# EAGLE schematic 20251027-temp_board (EAGLE 9.6.2)
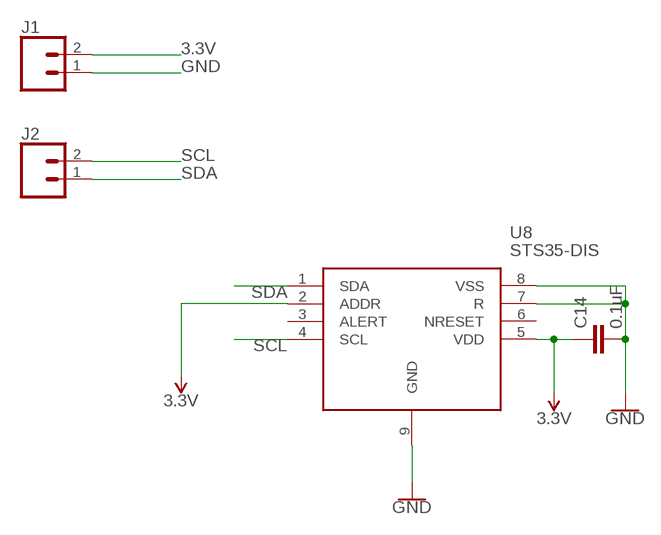
[diagram p0: schematic, sheet 1]

## Parts
C14  0.1uF  0.1UF-0603-25V-5%  [0603]
J1  CONN_02_1.5MM  [1X02_1.5MM_NO_SILK]
J2  CONN_02_1.5MM  [1X02_1.5MM_NO_SILK]
U8  STS35-DIS  [SON50P250X250X100-9N]

## Nets
3.3V: C14.1 J1.2 U8.2(ADDR) U8.5(VDD)
GND: C14.2 J1.1 U8.7(R) U8.8(VSS) U8.9(GND)
SCL: J2.2 U8.4(SCL)
SDA: J2.1 U8.1(SDA)
Unconnected: U8.3(ALERT) U8.6(NRESET)

## Library data of the parts
C14 = SparkFun-Capacitors:0.1UF: 0.1µF ceramic capacitors A capacitor is a passive two-terminal electrical component used to store electrical energy temporarily in an electric field.; PROD_ID: CAP-08604
J1 J2 = SparkFun-Connectors:CONN_02: Multi connection point. Often used as Generic Header-pin footprint for 0.1 inch spaced/style header connections On any of the 0.1 inch spaced packages, you can populate with these: Break Away Headers - Straight <https://www.sparkfun.com/products/116> (PRT-00116) Break Away Male Headers - Right Angle <https://www.sparkfun.com/products/553> (PRT-00553) Female Headers <https://www.sparkfun.com/products/115> (PRT-00115) Break Away Headers - Machine Pin <https://www.sparkfun.com/products/117> (PRT-00117) Break Away Female Headers - Swiss Machine Pin <https://www.sparkfun.com/products/743> (PRT-00743) For SCREWTERMINALS and SPRING TERMINALS visit here: Screw Terimnals on SparkFun.com <https://www.sparkfun.com/search/results?term=Screw+Terminals> (5mm/3.5mm/2.54mm spacing) This device is also useful as a general connection point to wire up your design to another part of your project. Our various solder wires solder well into these plated through hole pads. Hook-Up Wire - Assortment (Stranded, 22 AWG) <https://www.sparkfun.com/products/11375> (PRT-11375) Hook-Up Wire - Assortment (Solid Core, 22 AWG) <https://www.sparkfun.com/products/11367> (PRT-11367) View the entire wire category on our website here <https://www.sparkfun.com/categories/141> Special notes: Molex polarized connector foot print use with: PRT-08233 with associated crimp pins and housings. 2.54_SCREWTERM for use with PRT-10571. 3.5mm Screw Terminal footprints for PRT-08084 5mm Screw Terminal footprints for use with PRT-08432
U8 = STS35-DIS:STS35-DIS: Board Mount Temperature Sensors High-accuracy Digital Temperature Sensor IC Source: Datasheet <https://componentsearchengine.com/Datasheets/1/STS35-DIS.pdf>; DESCRIPTION: Board Mount Temperature Sensors High-accuracy Digital Temperature Sensor IC; HEIGHT: 1mm; MANUFACTURER_NAME: Sensirion; MANUFACTURER_PART_NUMBER: STS35-DIS; MOUSER_PART_NUMBER: 403-STS35-DIS; MOUSER_PRICE-STOCK: https://www.mouser.co.uk/ProductDetail/Sensirion/STS35-DIS?qs=F5EMLAvA7IBgq10iVaCNnw%3D%3D